# EAGLE schematic SAMD11 Feather Experiment (EAGLE 9.4.2)
COMPANY: ADAFRUIT INDUSTRIES; DRAWN: KTOWN; REV: B
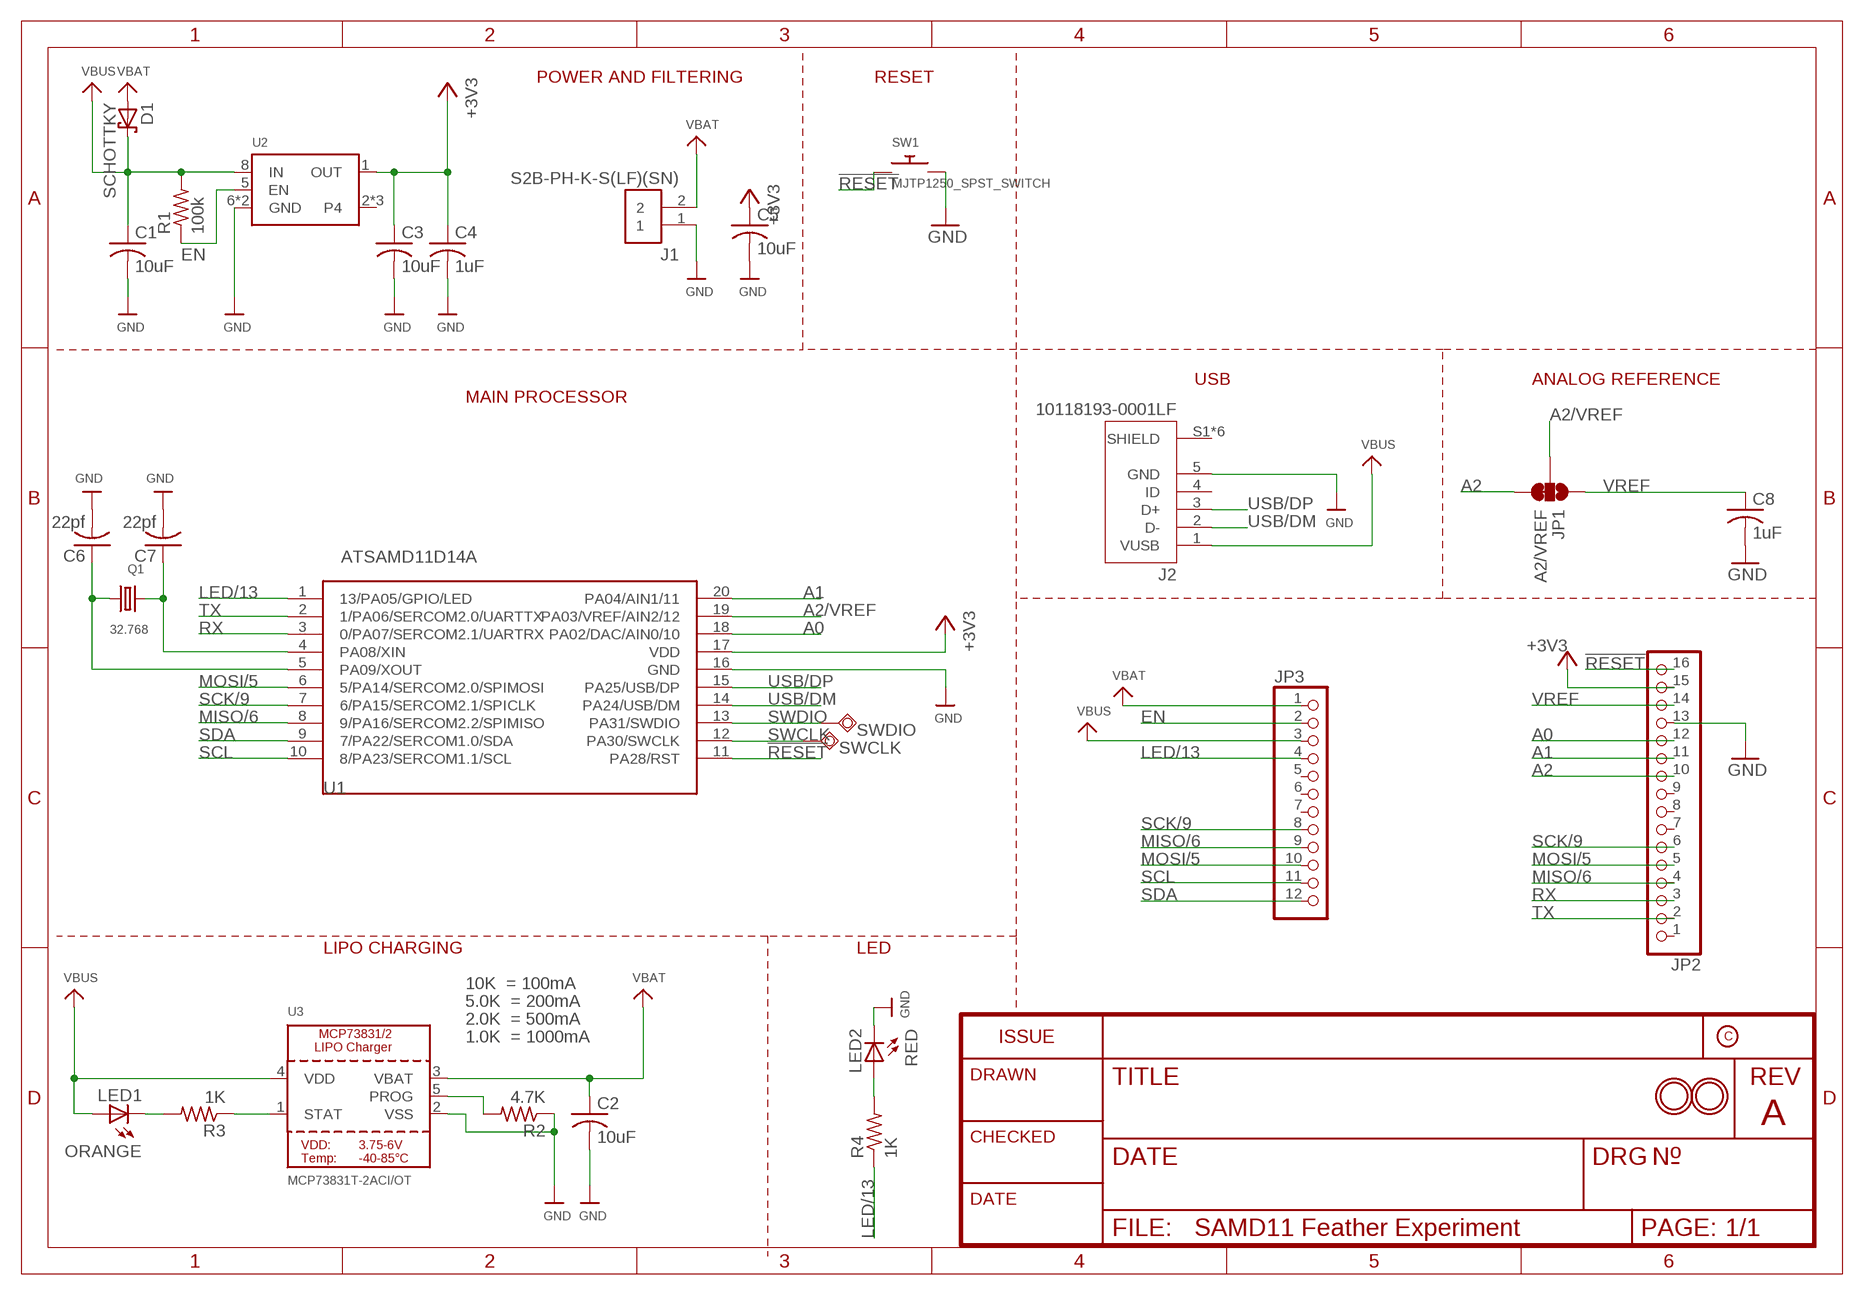
[diagram p0: schematic, sheet 1]
FRAME1 (FRAME_A4): REV: A

## Parts
C1  10uF  C-US050-025X075  [C050-025X075]
C2  10uF  C-US050-025X075  [C050-025X075]
C3  10uF  C-US050-025X075  [C050-025X075]
C4  1uF  C-US025-025X050  [C025-025X050]
C5  10uF  C-US050-025X075  [C050-025X075]
C6  22pf  C-US025-024X044  [C025-024X044]
C7  22pf  C-US025-024X044  [C025-024X044]
C8  1uF  C-US025-025X050  [C025-025X050]
D1  SCHOTTKY  SCHOTTKY-DIODEDO35-7  [DO35-7]
J1  S2B-PH-K-S(LF)(SN)  [JST_S2B-PH-K-S(LF)(SN)]
J2  10118193-0001LF  [FCI_10118193-0001LF]
JP1  A2/VREF  JUMPER-SMT_3_1-NC_TRACE_SILK  [SMT-JUMPER_3_1-NC_TRACE_SILK]
JP2  HEADER-1X16_MIN  [1X16_ROUND_MIN]
JP3  HEADER-1X12_MIN  [1X12_ROUND_MIN]
LED1  ORANGE  LED3MM  [LED3MM]
LED2  RED  LED3MM  [LED3MM]
Q1  32.768  CRYSTALTC38H  [TC38H]
R1  100k  R-US_0207/9  [0207/9]
R2  4.7K  R-US_0207/9  [0207/9]
R3  1K  R-US_0207/9  [0207/9]
R4  1K  R-US_0207/9  [0207/9]
SW1  MJTP1250_SPST_SWITCH  [MJTP1250]
SWCLK  TPSQTP20R  [TP20R]
SWDIO  TPSQTP20R  [TP20R]
U1  ATSAMD11D14A  [SOIC20L]
U2  MICROBUILDER_VREG_SOT23-5SO-8  [MICROBUILDER_SOIC8_150MIL]
U3  MCP73831T-2ACI/OT  MCP73831/2  [SOT23-5]
U$31  MOUNTINGHOLE2.5  [MOUNTINGHOLE_2.5_PLATED]
U$32  MOUNTINGHOLE2.5  [MOUNTINGHOLE_2.5_PLATED]

## Nets
!RESET: JP2.16 SW1.P$1 U1.11(PA28/RST)
+3V3 [Power]: C3.1 C4.1 C5.1 JP2.15 U1.17(VDD) U2.1(OUT)
A0: JP2.12 U1.18(PA02/DAC/AIN0/10)
A1: JP2.11 U1.20(PA04/AIN1/11)
A2: JP1.3 JP2.10
A2/VREF: JP1.2 U1.19(PA03/VREF/AIN2/12)
EN: JP3.2 R1.1 U2.5(EN)
GND: C1.2 C2.2 C3.2 C4.2 C5.2 C6.2 C7.2 C8.2 J1.1 J2.5(GND) JP2.13 LED2.K(C) R2.1 SW1.P$2 U1.16(GND) U2.6(GND) U2.7(GND) U3.2(VSS)
LED/13: JP3.4 R4.1 U1.1(13/PA05/GPIO/LED)
MISO/6: JP2.4 JP3.9 U1.8(9/PA16/SERCOM2.2/SPIMISO)
MOSI/5: JP2.5 JP3.10 U1.6(5/PA14/SERCOM2.0/SPIMOSI)
N$1: LED1.K(C) R3.2
N$2: LED2.A R4.2
PROG: R2.2 U3.5(PROG)
RX: JP2.3 U1.3(0/PA07/SERCOM2.1/UARTRX)
SCK/9: JP2.6 JP3.8 U1.7(6/PA15/SERCOM2.1/SPICLK)
SCL: JP3.11 U1.10(8/PA23/SERCOM1.1/SCL)
SDA: JP3.12 U1.9(7/PA22/SERCOM1.0/SDA)
STAT: R3.1 U3.1(STAT)
SWCLK: SWCLK.TP U1.12(PA30/SWCLK)
SWDIO: SWDIO.TP U1.13(PA31/SWDIO)
TX: JP2.2 U1.2(1/PA06/SERCOM2.0/UARTTX)
USB/DM [USB]: J2.2(D-) U1.14(PA24/USB/DM)
USB/DP [USB]: J2.3(D+) U1.15(PA25/USB/DP)
VBAT [Power]: C2.1 D1.A J1.2 JP3.1 U3.3(VBAT)
VBUS [Power]: C1.1 D1.C J2.1(VUSB) JP3.3 LED1.A R1.2 U2.8(IN) U3.4(VDD)
VREF: C8.1 JP1.1 JP2.14
XIN: C7.1 Q1.2 U1.4(PA08/XIN)
XOUT: C6.1 Q1.1 U1.5(PA09/XOUT)
Unconnected: J2.4(ID) J2.S1(SHIELD) J2.S2(SHIELD) J2.S3(SHIELD) J2.S4(SHIELD) J2.S5(SHIELD) J2.S6(SHIELD) JP2.1 JP2.7 JP2.8 JP2.9 JP3.5 JP3.6 JP3.7 U2.2(P4) U2.3(P4) U2.4

## Notes on the sheet
- POWER AND FILTERING | RESET
- USB | ANALOG REFERENCE
- MAIN PROCESSOR
- LIPO CHARGING | LED
- 10K  = 100mA
- 5.0K  = 200mA
- 2.0K  = 500mA
- 1.0K  = 1000mA

## Library data of the parts
C1-C8 = adafruit:C-US: CAPACITOR, American symbol
D1 = adafruit:SCHOTTKY-DIODE: Schottky Diode
J1 = S2B-PH-K-S_LF__SN_:S2B-PH-K-S(LF)(SN): PH Series 2 Position 2.0 mm Through Hole Side Entry Shrouded Header; DESCRIPTION: PH Series 2 Position 2.0 mm Through Hole Side Entry Shrouded Header; DIGI-KEY_PART_NUMBER: 455-1719-ND; DIGI-KEY_PURCHASE_URL: https://www.digikey.com/product-detail/en/jst-sales-america-inc/S2B-PH-K-S_LF__SN_/455-1719-ND/926626?utm_source=snapeda&utm_medium=aggregator&utm_campaign=symbol; MF: JST Sales; MP: S2B-PH-K-S_LF__SN_; PACKAGE: None
J2 = 10118193-0001LF:10118193-0001LF: Micro USB B Type Receptacle; DESCRIPTION: Single Port 5 Contact Shielded SMT MICRO USB B-Type Receptacle; DIGI-KEY_PART_NUMBER: 609-4616-1-ND; DIGI-KEY_PURCHASE_URL: https://www.digikey.com/product-detail/en/amphenol-icc-fci/10118193-0001LF/609-4616-1-ND/2785380?utm_source=snapeda&utm_medium=aggregator&utm_campaign=symbol; MF: Amphenol ICC; MP: 10118193-0001LF; PACKAGE: None
JP1 = SparkFun-Jumpers:JUMPER-SMT_3_1-NC_TRACE: Normally closed trace jumper (1 of 2 connections) This jumper has a trace between two pads so it's normally closed (NC). The other connection is normally open (NO). Use a razor knife to open the connection. For best results follow the IPC guidelines for cutting traces: Cutout at least 0.063 mm (0.005 in). Remove all loose material to clean up the cut area. Seal the cut with an approved epoxy. Reapply solder to reclose the connection, or to close the NO connection.
JP2 = microbuilder:HEADER-1X16: PIN HEADER
JP3 = microbuilder:HEADER-1X12
LED1 LED2 = adafruit:LED: LED OSRAM: - CHIPLED LG R971, LG N971, LY N971, LG Q971, LY Q971, LO R971, LY R971 LH N974, LH R974 LS Q976, LO Q976, LY Q976 LO Q996 - Hyper CHIPLED LW Q18S LB Q993, LB Q99A, LB R99A - SideLED LS A670, LO A670, LY A670, LG A670, LP A670 LB A673, LV A673, LT A673, LW A673 LH A674 LY A675 LS A676, LA A676, LO A676, LY A676, LW A676 LS A679, LY A679, LG A679 - Hyper Micro SIDELED® LS Y876, LA Y876, LO Y876, LY Y876 LT Y87S - SmartLED LW L88C, LW L88S LB L89C, LB L89S, LG L890 LS L89K, LO L89K, LY L89K LS L896, LA L896, LO L896, LY L896 - TOPLED LS T670, LO T670, LY T670, LG T670, LP T670 LSG T670, LSP T670, LSY T670, LOP T670, LYG T670 LG T671, LOG T671, LSG T671 LB T673, LV T673, LT T673, LW T673 LH T674 LS T676, LA T676, LO T676, LY T676, LB T676, LH T676, LSB T676, LW T676 LB T67C, LV T67C, LT T67C, LS T67K, LO T67K, LY T67K, LW E67C LS E67B, LA E67B, LO E67B, LY E67B, LB E67C, LV E67C, LT E67C LW T67C LS T679, LY T679, LG T679 LS T770, LO T770, LY T770, LG T770, LP T770 LB T773, LV T773, LT T773, LW T773 LH T774 LS E675, LA E675, LY E675, LS T675 LS T776, LA T776, LO T776, LY T776, LB T776 LHGB T686 LT T68C, LB T68C - Hyper Mini TOPLED® LB M676 - Mini TOPLED Santana® LG M470 LS M47K, LO M47K, LY M47K Source: http://www.osram.convergy.de/
Q1 = adafruit:CRYSTAL: CRYSTAL; OC_FARNELL: unknown; OC_NEWARK: unknown
R1-R4 = adafruit:R-US_: RESISTOR, American symbol
SW1 = My Stuff:MJTP1250_SPST_SWITCH
SWCLK SWDIO = testpad:TPSQ: Test pad
U1 = My Stuff:ATSAMD11D14A
U2 = Adafruit Feather M0 Express:MICROBUILDER_VREG_SOT23-5: SOT23-5 Fixed Voltage Regulators Part Current Out V Out V In V Dropout θJA (°C/W) TJ (°C) Digikey Part No. ADP121 150mA 3.3V 3.4-5.5V 0.09V @ 150mA -- -- ADP121-AUJZ33R7CT-ND ADP121 150mA 3.0V 3.1-5.5V 0.09V @ 150mA -- -- ADP121-AUJZ30R7CT-ND ADP122 300mA 3.3V 3.4-5.5V 0.085V @ 300mA -- -- ADP122AUJZ-3.3-R7CT-ND ADP1712 300mA 3.3V 3.5-5.5V 0.17V @ 300mA -- -- ADP1712AUJZ-3.3-R7TR-ND AP7311 (Low Cost) 150mA 3.3V 3.5-6V 0.15V @ 150mA -- -- AP7311-33WG-7DICT-ND LD39015M18R 150mA 1.8V 1.9V-5.5V 0.08V @ 100mA -- -- 497-6977-1-ND LP2985A-33DBVR 150mA 3.3V 3.3-16V 0.28V @ 150mA 206 150 296-18479-1-ND MCP1824T-3302E/OT 300mA 3.3V 3.5V-6V 0.2V @ 300mA -- -- MCP1824T-3302E/OTCT-ND MIC5205-2.5YM5 TR 150mA 2.5V 2.7-16V 0.165V @ 150mA -- -- 576-1257-2-ND MIC5205-3.0YM5 TR 150mA 3.0V 3.2V-16V 0.165V @ 150mA -- -- 576-1258-2-ND MIC5205-3.3YM5 TR 150mA 3.3V 3.5V-16V 0.165V @ 150mA -- -- 576-1259-2-ND TPS780330220 150mA 3.3V+2.2V 3.6-5.5V 250mV Max -- -- 296-23332-1-ND TDA3663/N1,135 100mA 3.3V 3.5-45V 0.18V @ 50mA -- -- 568-5343-1-ND Max operating temp can be calculated using θJA, TJ (max junction temperature), and power in watts. Set the "Maximum Ambient Temperature" until it reaches TJ ("Max Junction Temperature"), which is the absolute limit for safe use of the regulator: Heat Sink Temperature Calculator <http://www.daycounter.com/Calculators/Heat-Sink-Temperature-Calculator.phtml> For example, With 12V source into a 3.3V LP2985 and a 30mA load, we are dissipating (12V-3.3V) * 0.03A = 0.261W. With a θJA of 206 °C/W, a TJ of 150°C, and 261mW we can safely use the chip without a heat sink up to 75°C (=147.1°C Junction Temperature).
U3 = microbuilder:MCP73831/2: MCP73831/2 LIPO Charger VDD: 3.75 - 6V Temp -40 - 85°C Programmable Charge Rate: 15-500mA NOTE: STAT is a tri-state logic output on the MCP73831 and an open-drain output on the MCP73832. SOT23-5 with 4.2V output and tri-state logic on STAT = MCP73831T-2ACI/OT
U$31 U$32 = microbuilder:MOUNTINGHOLE: Mounting Hole For #2 screws (0.086"/2.18mm width, 0.094"/2.4mm hole) use 2.5mm; BOM: EXCLUDE

## Net classes
0 default: width 0.254 mm
1 USB: width 0.254 mm
2 Power: width 0.406 mm